# Altium project JacdacBreadboardConnectorEc30 131.PrjPCB
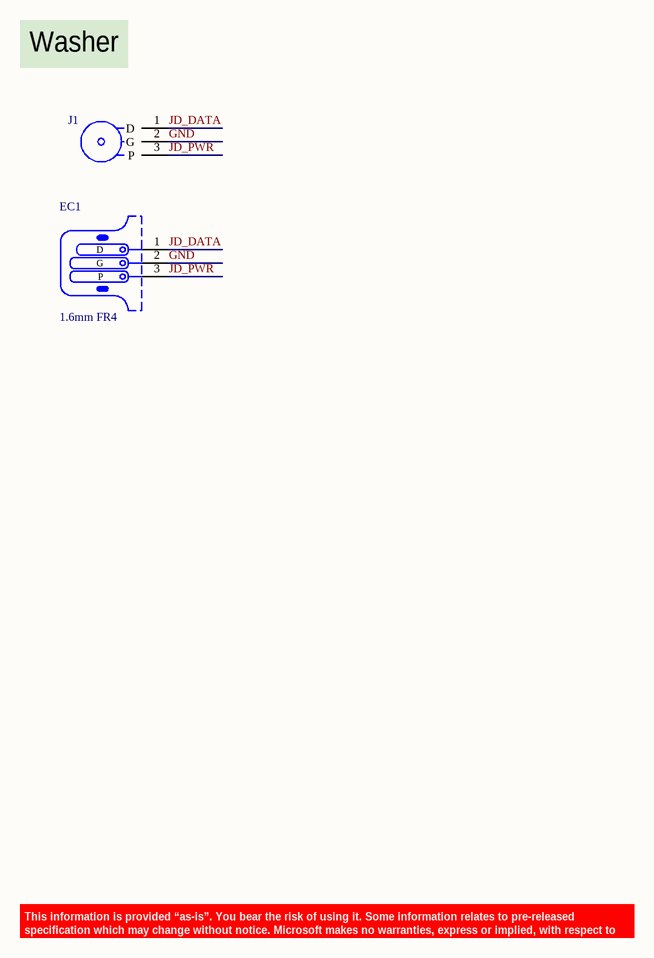
[diagram p0: JacdacBreadboardConnectorEc30 131.SchDoc]
ProjectRevision: 0.1; ProjectLicenceTerms: Attribution 4.0 International (CC BY 4.0); ProjectDrawnBy: S. Hodges; ProjectCodenameID: 131; ProjectCodenameDescription: Jacdac connector adapter for EC30 breadbaords; ProjectCodeName: JacdacBreadboardConnectorEc30
1 sheet, 2 parts. Net scope: global (net labels, ports and power ports of the same name join across sheets).
Board file: JacdacBreadboardConnectorEc30 131.PcbDoc

## Sheet JacdacBreadboardConnectorEc30 131.SchDoc: Complete design
size A4; DrawnBy: S. Hodges; DocumentNumber: 1; Revision: 0.1; SheetNumber: 1; SheetTotal: 1; VersionControl_RevNumber: 1

### Parts
EC1  PCB Type: 1.6mm FR4  [JACDAC_EDGE_CONNECTOR_NO_TRACES_3D_PADS]  (hidden comment: Jacdac edge connector)  (no BOM)
J1  Jacdac breadboard washer all signals  [Jacdac_breadboard_transition_hole_rings_allpins]  (value not drawn)

### Nets
GND: EC1.2(G) J1.2(G)
JD_DATA: EC1.1(D) J1.1(D)
JD_PWR: EC1.3(P) J1.3(P)

### Notes on the sheet
- Washer
- This information is provided “as-is”. You bear the risk of using it. Some information relates to pre-released specification which may change without notice. Microsoft makes no warranties, express or implied, with respect to the information provided here.
- PROJECT FILENAME
- PROJECT CODENAME
- Microsoft
- PROJECT DESCRIPTION
- SHEET DESCRIPTION
- SHEET FILENAME
- LICENCE
- LAST MODIFIED
- PAGE
- OF
- DRAWN BY
- REVISION
- PCB ID

### Library data of the parts
EC1 = Jacdac edge connector: 3 pin Jacdac edge connector 1.27mm pitch; Created By: D. Gakure & S. Hodges; Manufacturer Part Number: n/a; ComponentLink1Description: Yuliang JACDAC cable connector drawing online; ComponentLink1URL: https://github.com/microsoft/jacdac-ddk/tree/main/connector; ComponentLink2Description: JACDAC PCB edge connector spec onlin; ComponentLink2URL: https://github.com/microsoft/jacdac-ddk/tree/main/connector
J1 = Jacdac breadboard washer all signals: Hole Size: M3; Hole Clearance: 7.0mm